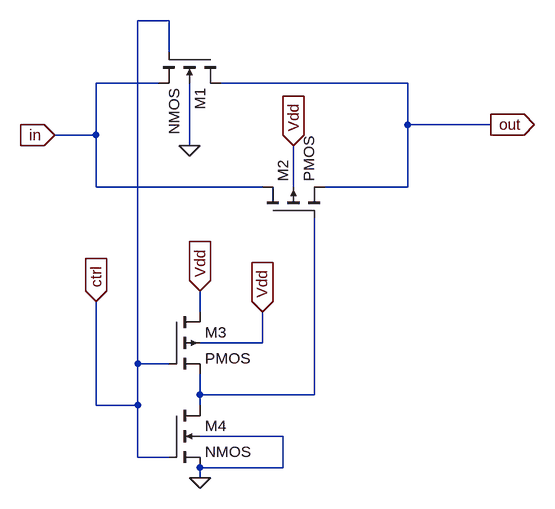
[diagram p0: schematic switch.asc]
switch.asc, the LTspice schematic file:
Version 4
SHEET 1 880 680
WIRE 48 -192 0 -192
WIRE 48 -144 48 -192
WIRE 32 -96 -64 -96
WIRE 416 -96 128 -96
WIRE 416 -32 416 -96
WIRE 544 -32 416 -32
WIRE -64 -16 -64 -96
WIRE -64 -16 -128 -16
WIRE 80 0 80 -96
WIRE -64 64 -64 -16
WIRE 192 64 -64 64
WIRE 240 64 240 0
WIRE 416 64 416 -32
WIRE 416 64 288 64
WIRE 96 256 96 224
WIRE 192 304 192 256
WIRE 192 304 96 304
WIRE 0 336 0 -192
WIRE 48 336 0 336
WIRE 96 384 96 352
WIRE 272 384 272 112
WIRE 272 384 96 384
WIRE -64 400 -64 240
WIRE 0 400 0 336
WIRE 0 400 -64 400
WIRE 96 400 96 384
WIRE 224 448 96 448
WIRE 0 480 0 400
WIRE 48 480 0 480
WIRE 224 496 224 448
WIRE 224 496 96 496
WIRE 96 512 96 496
FLAG 80 0 0
FLAG 240 0 Vdd
IOPIN 240 0 In
FLAG -128 -16 in
IOPIN -128 -16 In
FLAG 544 -32 out
IOPIN 544 -32 Out
FLAG 96 512 0
FLAG 96 224 Vdd
IOPIN 96 224 In
FLAG 192 256 Vdd
IOPIN 192 256 In
FLAG -64 240 ctrl
IOPIN -64 240 In
SYMBOL nmos4 128 -144 R90
SYMATTR InstName M1
SYMATTR Value2 l=200n w=Wsw
SYMBOL pmos4 192 112 R270
SYMATTR InstName M2
SYMATTR Value2 l=200n w={Wsw*2}
SYMBOL pmos4 48 256 R0
SYMATTR InstName M3
SYMATTR Value2 l=200n w={Wsw*2}
SYMBOL nmos4 48 400 R0
SYMATTR InstName M4
SYMATTR Value2 l=200n w=Wsw

The netlist it stands for:
* switch.asc
M1 out ctrl in 0 NMOS l=200n w=Wsw
M2 in N001 out Vdd PMOS l=200n w={Wsw*2}
M3 Vdd ctrl N001 Vdd PMOS l=200n w={Wsw*2}
M4 N001 ctrl 0 0 NMOS l=200n w=Wsw
.model NMOS NMOS
.model PMOS PMOS
.lib standard.mos
.backanno
.end